# Altium schematic sheet CG65_Schematics.SchDoc
size A4; SheetNumber: 1; SheetTotal: 1
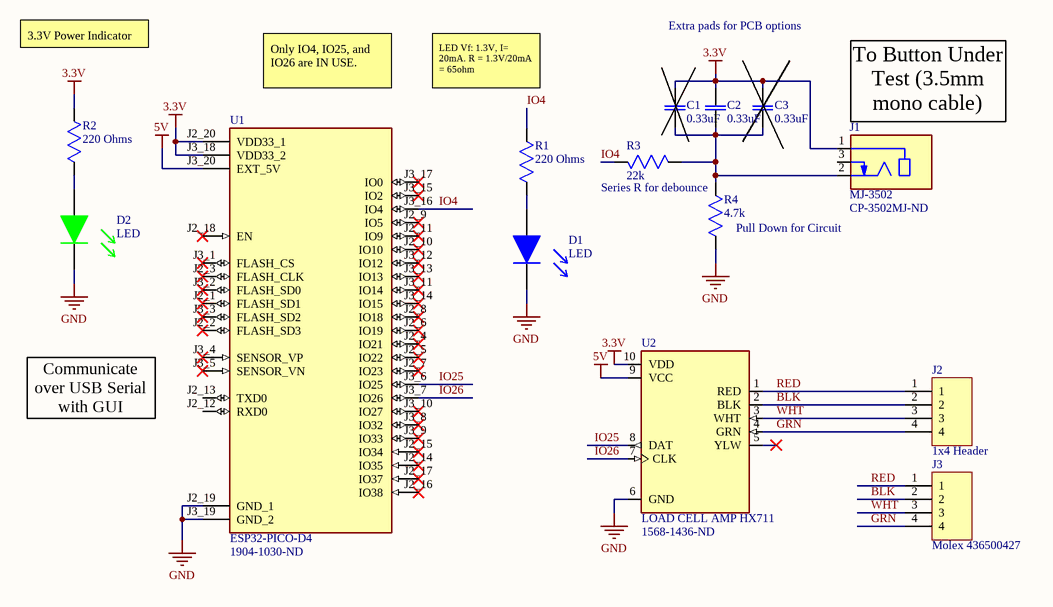
[diagram p0: CG65_Schematics.SchDoc]

## Parts
C1  0.33uF  [TH CAPACITOR]
C2  0.33uF  [TH CAPACITOR]
C3  0.33uF  [TH CAPACITOR]
D1  LED  [LED TH]
D2  LED  [LED TH]
J1  MJ-3502  Supplier Part Number 1: CP-3502MJ-ND  [MJ-3502N]
J2  1x4 Header  [1x4 Standard Header]
J3  Molex 436500427  [MOLEX_436500427]
R1  220 Ohms  [TH Resistor]
R2  220 Ohms  [TH Resistor]
R3  22k  [TH Resistor]
R4  4.7k  [TH Resistor]
U1  ESP32-PICO-D4  Supplier Part Number 1: 1904-1030-ND  [ESP32-PICO-KIT]
U2  LOAD CELL AMP HX711  Supplier Part Number 1: 1568-1436-ND  [SEN-13879]

## Nets
3.3V: C1.2 C2.2 C3.2 J1.1 R2.2(R2) U1.J2_20(VDD33_1) U1.J3_18(VDD33_2) U2.10(VDD)
5V: U1.J3_20(EXT_5V) U2.9(VCC)
GND: D1.1 D2.1 R4.1(R1) U1.J2_19(GND_1) U1.J3_19(GND_2) U2.6(GND)
BLK: J2.2 J3.2 U2.2(BLK)
GRN: J2.4 J3.4 U2.4(GRN)
IO4: R1.2(R2) R3.2(R2) U1.J3_16(IO4)
IO25: U1.J3_6(IO25) U2.8(DAT)
IO26: U1.J3_7(IO26) U2.7(CLK)
RED: J2.1 J3.1 U2.1(RED)
WHT: J2.3 J3.3 U2.3(WHT)
NetC1_1: C1.1 C2.1 C3.1 J1.2 R3.1(R1) R4.2(R2)
NetD1_2: D1.2 R1.1(R1)
NetD2_2: D2.2 R2.1(R1)

Not connected (* = marked no-connect by the designer): J1 3; U1 J2_1(FLASH_SD1)* J2_2(FLASH_SD3)* J2_3(FLASH_CLK)* J2_4(IO21)* J2_5(IO22)* J2_6(IO19)* J2_7(IO23)* J2_8(IO18)* J2_9(IO5)* J2_10(IO10)* J2_11(IO9)* J2_12(RXD0) J2_13(TXD0) J2_14(IO35)* J2_15(IO34)* J2_16(IO38)* J2_17(IO37)* J2_18(EN)* J3_1(FLASH_CS)* J3_2(FLASH_SD0)* J3_3(FLASH_SD2)* J3_4(SENSOR_VP)* J3_5(SENSOR_VN)* J3_8(IO32)* J3_9(IO33)* J3_10(IO27)* J3_11(IO14)* J3_12(IO12)* J3_13(IO13)* J3_14(IO15)* J3_15(IO2)* J3_17(IO0)*; U2 5(YLW)*

## Notes on the sheet
- 3.3V Power Indicator
- Only IO4, IO25, and IO26 are IN USE.
- LED Vf: 1.3V, I= 20mA. R = 1.3V/20mA = 65ohm
- Extra pads for PCB options
- (near J1) To Button Under Test (3.5mm mono cable)
- (near R4) Series R for debounce
- (near R4) Pull Down for Circuit
- Communicate over USB Serial with GUI

## Library data of the parts
C1-C3 = Capacitor: Standard Capacitor, Through Hole; Supplier 1: Newark; Supplier Part Number 1: 74X9713
D1 = LED Blue: 2V Blue LED Through Hole
D2 = LED Green: 2V Green LED Through Hole
J1 = MJ-3502: 3.5 mm, Mono, Right Angle, Through Hole, Threaded Bushing, Audio Jack Connector; Manufacturer: CUI; Body Material: Brass; Body Color: Black; Gender: Female; Shielding: Unshielded; Current Rating: 1A; Number of Conductors: 2; Number of Ports: 1; Supplier 1: Digi-Key; Manufacturer Part Number: MJ-3502; RoHS: Yes; Category: Uncategorized; Mount: Through Hole,Panel; Color: Black; Contact Plating: Silver; Series: -; Packaging: Bulk; Termination: Solder; Orientation: Horizontal; Connector Type: Jack; Diameter: 3.5mm; Lead Free: Lead Free; ComponentLink1URL: https://www.cui.com/product/resource/digikeypdf/mj-3502.pdf?src-supplier=Digi-Key; ComponentLink1Description: https://www.cui.com/product/resource/digikeypdf/mj-3502.pdf?src-supplier=Digi-Key
J2 = 1x4 Header: Standard 0.1" Header 1x4
J3 = Molex 436500427: Molex MicroFit 3.0 Header 1x4, mates with 0436450400
R1-R4 = Resistor: Standard Resistor, Through Hole, 1/8W
U1 = ESP32-PICO-KIT: ESP32 Wifi Bluetooth Eval Board; Manufacturer: Espressif Systems; Frequency: 2.4GHz; Supplier 1: Digi-Key; Manufacturer Part Number: ESP32-PICO-KIT; RoHS: No; Category: RF Semiconductors and Devices; Stock 1: 467; Pricing 1: 1=10.00000 (USD); ComponentLink1URL: https://esp-idf.readthedocs.io/en/latest/get-started/get-started-pico-kit.html?src-supplier=Digi-Key; ComponentLink1Description: https://esp-idf.readthedocs.io/en/latest/get-started/get-started-pico-kit.html?src-supplier=Digi-Key
U2 = LOAD CELL AMP HX711: HX711 Load Cell Amplifier; Manufacturer: SparkFun; Output Type: Digital; Operating Supply Current: 1.5mA; Supplier 1: Digi-Key; Manufacturer Part Number: SEN-13879; RoHS: No; Stock 1: 1086; Pricing 1: 1=10.95000 (USD); Min Operating Temperature: -45°C; Max Operating Temperature: 85°C